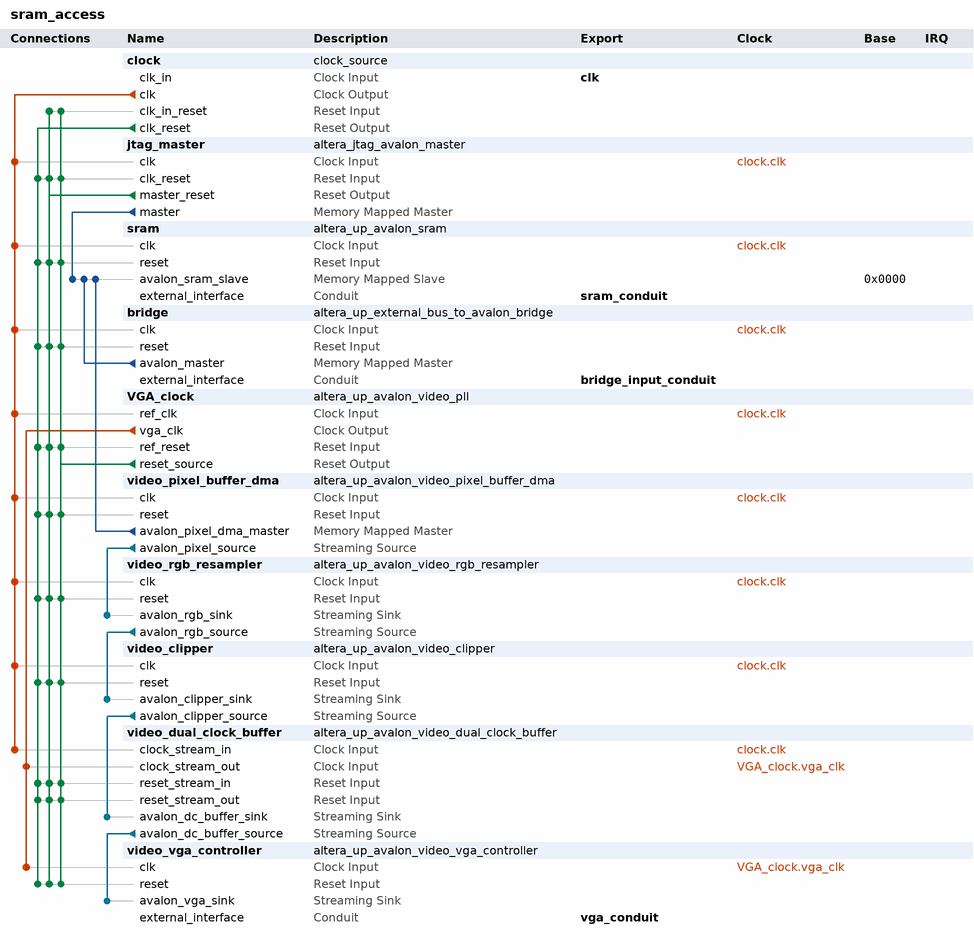
[diagram p0: system contents]
# Platform Designer (Qsys) system sram_access, Cyclone IV E EP4CE115F29C7
# Parameters at their usual value, and those the tool derives, are not listed.
package require -exact qsys 15.1
create_system sram_access
set_project_property DEVICE_FAMILY {Cyclone IV E}
set_project_property DEVICE EP4CE115F29C7

add_instance clock clock_source 16.0
set_instance_parameter_value clock clockFrequency 50000000

add_instance jtag_master altera_jtag_avalon_master 16.0

add_instance sram altera_up_avalon_sram 15.1
set_instance_parameter_value sram board DE2-115
set_instance_parameter_value sram pixel_buffer false

add_instance bridge altera_up_external_bus_to_avalon_bridge 15.1
set_instance_parameter_value bridge addr_size 2
set_instance_parameter_value bridge addr_size_multiplier Mbytes
set_instance_parameter_value bridge data_size 16

add_instance VGA_clock altera_up_avalon_video_pll 15.1
set_instance_parameter_value VGA_clock camera {5MP Digital Camera}
set_instance_parameter_value VGA_clock gui_refclk 50.0
set_instance_parameter_value VGA_clock lcd {7" LCD on VEEK-MT and MTL Module}

add_instance video_pixel_buffer_dma altera_up_avalon_video_pixel_buffer_dma 15.1
set_instance_parameter_value video_pixel_buffer_dma addr_mode Consecutive
set_instance_parameter_value video_pixel_buffer_dma back_start_address 0
set_instance_parameter_value video_pixel_buffer_dma color_space {16-bit RGB}
set_instance_parameter_value video_pixel_buffer_dma image_height 256
set_instance_parameter_value video_pixel_buffer_dma image_width 256
set_instance_parameter_value video_pixel_buffer_dma start_address 0

add_instance video_rgb_resampler altera_up_avalon_video_rgb_resampler 16.0
set_instance_parameter_value video_rgb_resampler alpha 1023
set_instance_parameter_value video_rgb_resampler input_type {16-bit RGB}
set_instance_parameter_value video_rgb_resampler output_type {30-bit RGB}

add_instance video_clipper altera_up_avalon_video_clipper 15.1
set_instance_parameter_value video_clipper add_bottom 112
set_instance_parameter_value video_clipper add_left 192
set_instance_parameter_value video_clipper add_right 192
set_instance_parameter_value video_clipper add_top 112
set_instance_parameter_value video_clipper color_bits 10
set_instance_parameter_value video_clipper color_planes 3
set_instance_parameter_value video_clipper drop_bottom 0
set_instance_parameter_value video_clipper drop_left 0
set_instance_parameter_value video_clipper drop_right 0
set_instance_parameter_value video_clipper drop_top 0
set_instance_parameter_value video_clipper height_in 256
set_instance_parameter_value video_clipper width_in 256

add_instance video_dual_clock_buffer altera_up_avalon_video_dual_clock_buffer 15.1
set_instance_parameter_value video_dual_clock_buffer color_bits 10

add_instance video_vga_controller altera_up_avalon_video_vga_controller 15.1
set_instance_parameter_value video_vga_controller board DE2-115
set_instance_parameter_value video_vga_controller resolution {VGA 640x480}

# connections
add_connection clock.clk bridge.clk clock
add_connection clock.clk jtag_master.clk clock
add_connection clock.clk sram.clk clock
add_connection clock.clk VGA_clock.ref_clk clock
add_connection clock.clk video_clipper.clk clock
add_connection clock.clk video_dual_clock_buffer.clock_stream_in clock
add_connection clock.clk video_pixel_buffer_dma.clk clock
add_connection clock.clk video_rgb_resampler.clk clock
add_connection VGA_clock.vga_clk video_dual_clock_buffer.clock_stream_out clock
add_connection VGA_clock.vga_clk video_vga_controller.clk clock
add_connection clock.clk_reset bridge.reset reset
add_connection clock.clk_reset jtag_master.clk_reset reset
add_connection clock.clk_reset sram.reset reset
add_connection clock.clk_reset VGA_clock.ref_reset reset
add_connection clock.clk_reset video_clipper.reset reset
add_connection clock.clk_reset video_dual_clock_buffer.reset_stream_in reset
add_connection clock.clk_reset video_dual_clock_buffer.reset_stream_out reset
add_connection clock.clk_reset video_pixel_buffer_dma.reset reset
add_connection clock.clk_reset video_rgb_resampler.reset reset
add_connection clock.clk_reset video_vga_controller.reset reset
add_connection jtag_master.master_reset bridge.reset reset
add_connection jtag_master.master_reset clock.clk_in_reset reset
add_connection jtag_master.master_reset jtag_master.clk_reset reset
add_connection jtag_master.master_reset sram.reset reset
add_connection jtag_master.master_reset VGA_clock.ref_reset reset
add_connection jtag_master.master_reset video_clipper.reset reset
add_connection jtag_master.master_reset video_dual_clock_buffer.reset_stream_in reset
add_connection jtag_master.master_reset video_dual_clock_buffer.reset_stream_out reset
add_connection jtag_master.master_reset video_pixel_buffer_dma.reset reset
add_connection jtag_master.master_reset video_rgb_resampler.reset reset
add_connection jtag_master.master_reset video_vga_controller.reset reset
add_connection VGA_clock.reset_source bridge.reset reset
add_connection VGA_clock.reset_source clock.clk_in_reset reset
add_connection VGA_clock.reset_source jtag_master.clk_reset reset
add_connection VGA_clock.reset_source sram.reset reset
add_connection VGA_clock.reset_source VGA_clock.ref_reset reset
add_connection VGA_clock.reset_source video_clipper.reset reset
add_connection VGA_clock.reset_source video_dual_clock_buffer.reset_stream_in reset
add_connection VGA_clock.reset_source video_dual_clock_buffer.reset_stream_out reset
add_connection VGA_clock.reset_source video_pixel_buffer_dma.reset reset
add_connection VGA_clock.reset_source video_rgb_resampler.reset reset
add_connection VGA_clock.reset_source video_vga_controller.reset reset
add_connection bridge.avalon_master sram.avalon_sram_slave avalon
set_connection_parameter_value bridge.avalon_master/sram.avalon_sram_slave baseAddress 0x0000
add_connection jtag_master.master sram.avalon_sram_slave avalon
set_connection_parameter_value jtag_master.master/sram.avalon_sram_slave baseAddress 0x0000
add_connection video_pixel_buffer_dma.avalon_pixel_dma_master sram.avalon_sram_slave avalon
set_connection_parameter_value video_pixel_buffer_dma.avalon_pixel_dma_master/sram.avalon_sram_slave baseAddress 0x0000
add_connection video_clipper.avalon_clipper_source video_dual_clock_buffer.avalon_dc_buffer_sink avalon_streaming
add_connection video_dual_clock_buffer.avalon_dc_buffer_source video_vga_controller.avalon_vga_sink avalon_streaming
add_connection video_pixel_buffer_dma.avalon_pixel_source video_rgb_resampler.avalon_rgb_sink avalon_streaming
add_connection video_rgb_resampler.avalon_rgb_source video_clipper.avalon_clipper_sink avalon_streaming

# exported interfaces
add_interface bridge_input_conduit conduit end
set_interface_property bridge_input_conduit EXPORT_OF bridge.external_interface
add_interface clk clock sink
set_interface_property clk EXPORT_OF clock.clk_in
add_interface sram_conduit conduit end
set_interface_property sram_conduit EXPORT_OF sram.external_interface
add_interface vga_conduit conduit end
set_interface_property vga_conduit EXPORT_OF video_vga_controller.external_interface

set_interconnect_requirement {$system} qsys_mm.clockCrossingAdapter HANDSHAKE
set_interconnect_requirement {$system} qsys_mm.enableEccProtection FALSE
set_interconnect_requirement {$system} qsys_mm.insertDefaultSlave FALSE
set_interconnect_requirement {$system} qsys_mm.maxAdditionalLatency 1

save_system sram_access.qsys
